# Altium schematic sheet 51单片机密码锁.SchDoc
size A4
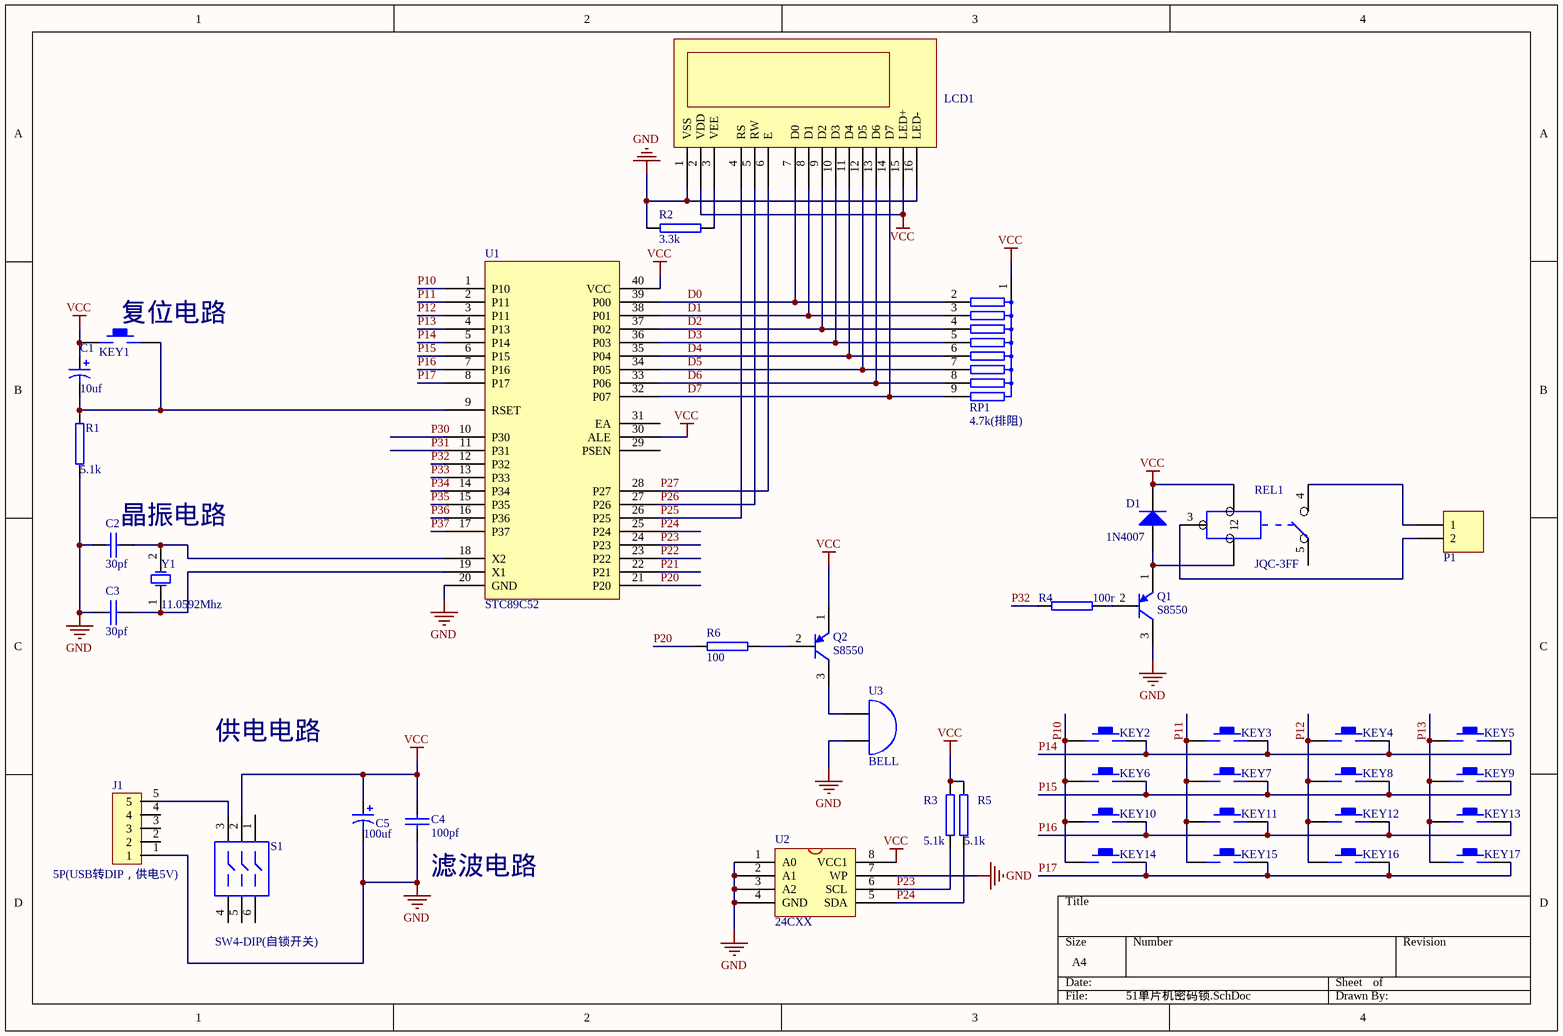
[diagram p0: 51单片机密码锁.SchDoc]

## Parts
C1  10uf  [RB.2/.4]
C2  30pf  [C0.2]
C3  30pf  [C0.2]
C4  100pf  [C0.2]
C5  100uf  [RB.2/.4]
D1  Type: 1N4007  [DIODE-0.4]  (hidden comment: Diode)
J1  5P(USB转DIP，供电5V)  [5P]
KEY1  KEY  [KEY]  (value not drawn)
KEY2  KEY  [KEY]  (value not drawn)
KEY3  KEY  [KEY]  (value not drawn)
KEY4  KEY  [KEY]  (value not drawn)
KEY5  KEY  [KEY]  (value not drawn)
KEY6  KEY  [KEY]  (value not drawn)
KEY7  KEY  [KEY]  (value not drawn)
KEY8  KEY  [KEY]  (value not drawn)
KEY9  KEY  [KEY]  (value not drawn)
KEY10  KEY  [KEY]  (value not drawn)
KEY11  KEY  [KEY]  (value not drawn)
KEY12  KEY  [KEY]  (value not drawn)
KEY13  KEY  [KEY]  (value not drawn)
KEY14  KEY  [KEY]  (value not drawn)
KEY15  KEY  [KEY]  (value not drawn)
KEY16  KEY  [KEY]  (value not drawn)
KEY17  KEY  [KEY]  (value not drawn)
LCD1  LCD1602  [SIP16]  (value not drawn)
P1  Header 2  [HDR2X1_A]  (value not drawn)
Q1  S8550  [TO-92A]
Q2  S8550  [TO-92A]
R1  5.1k  [AXIAL0.4]
R2  3.3k  [AXIAL0.4]
R3  5.1k  [AXIAL0.4]
R4  100r  [AXIAL0.4]
R5  5.1k  [AXIAL0.4]
R6  100  [AXIAL0.4]
REL1  JQC-3FF  [JQC-3FF-1]
RP1  4.7k(排阻)  [SIP9]
S1  SW4-DIP(自锁开关)  [SW6]
U1  STC89C52  [DIP40]
U2  24CXX  [DIP8]
U3  BELL  [BELL]
Y1  11.0592Mhz  [CRYSTAL]

## Nets
GND: C2.1 C3.1 C4.1 C5.2 J1.1 LCD1.1(VSS) LCD1.16(LED-) Q1.3(C) R1.1 R2.1 U1.20(GND) U2.1(A0) U2.2(A1) U2.3(A2) U2.4(GND) U2.7(WP) U3.2(B)
VCC: C1.1 C4.2 C5.1 D1.2(K) KEY1.1 LCD1.2(VDD) LCD1.15(LED+) Q2.1(E) R3.2 R5.2 REL1.2 RP1.1 S1.2 U1.30(ALE) U1.40(VCC) U2.8(VCC1)
D0: LCD1.7(D0) RP1.2 U1.39(P00)
D1: LCD1.8(D1) RP1.3 U1.38(P01)
D2: LCD1.9(D2) RP1.4 U1.37(P02)
D3: LCD1.10(D3) RP1.5 U1.36(P03)
D4: LCD1.11(D4) RP1.6 U1.35(P04)
D5: LCD1.12(D5) RP1.7 U1.34(P05)
D6: LCD1.13(D6) RP1.8 U1.33(P06)
D7: LCD1.14(D7) RP1.9 U1.32(P07)
P10: KEY2.1 KEY6.1 KEY10.1 KEY14.1 U1.1(P10)
P11: KEY3.1 KEY7.1 KEY11.1 KEY15.1 U1.2(P11)
P12: KEY4.1 KEY8.1 KEY12.1 KEY16.1 U1.3(P11)
P13: KEY5.1 KEY9.1 KEY13.1 KEY17.1 U1.4(P13)
P14: KEY2.2 KEY3.2 KEY4.2 KEY5.2 U1.5(P14)
P15: KEY6.2 KEY7.2 KEY8.2 KEY9.2 U1.6(P15)
P16: KEY10.2 KEY11.2 KEY12.2 KEY13.2 U1.7(P16)
P17: KEY14.2 KEY15.2 KEY16.2 KEY17.2 U1.8(P17)
P20: R6.1 U1.21(P20)
P21: U1.22(P21)
P22: U1.23(P22)
P23: R3.1 U1.24(P23) U2.6(SCL)
P24: R5.1 U1.25(P24) U2.5(SDA)
P25: LCD1.4(RS) U1.26(P25)
P26: LCD1.5(RW) U1.27(P26)
P27: LCD1.6(E) U1.28(P27)
P30: U1.10(P30)
P31: U1.11(P31)
P32: R4.1 U1.12(P32)
P33: U1.13(P33)
P34: U1.14(P34)
P35: U1.15(P35)
P36: U1.16(P36)
P37: U1.17(P37)
NetC1_2: C1.2 KEY1.2 R1.2 U1.9(RSET)
NetC2_2: C2.2 U1.18(X2) Y1.2(OSC2)
NetC3_2: C3.2 U1.19(X1) Y1.1(OSC1)
NetD1_1: D1.1(A) Q1.1(E) REL1.1
NetJ1_5: J1.5 S1.3
NetLCD1_3: LCD1.3(VEE) R2.2
NetP1_1: P1.1 REL1.4
NetP1_2: P1.2 REL1.3
NetQ1_2: Q1.2(B) R4.2
NetQ2_2: Q2.2(B) R6.2
NetQ2_3: Q2.3(C) U3.1(A)

Not connected (* = marked no-connect by the designer): J1 2 3 4; REL1 5; S1 1 4 5 6; U1 29(PSEN) 31(EA)

## Notes on the sheet
- (near KEY1) 复位电路
- (near C2) 晶振电路
- 供电电路
- (near C4) 滤波电路

## Library data of the parts
C1 C5 = CAPPOL: Polarized Capacitor (Axial); Published: 8-Jun-2000; LatestRevisionDate: 17-Jul-2002; LatestRevisionNote: Re-released for DXP Platform.; PackageReference: POLAR0.8; Publisher: Altium Limited
  C1: Vaule: 10uf
  C5: Vaule: 100uF
C2 C3 = CAP: Value: 30pF
C4 = CAP: Value: 30pF
D1 = Diode: 二极管; Published: 8-Jun-2000; LatestRevisionDate: 17-Jul-2002; LatestRevisionNote: Re-released for DXP Platform.; PackageDocument: Sep-1996; PackageReference: SMC; Publisher: Altium Limited; Code_JEDEC: DO-214-AB
J1 = 5P
KEY2-KEY17 = KEY: 按键
P1 = Header 2: 接插件; LatestRevisionDate: 17-Jul-2002; LatestRevisionNote: Re-released for DXP Platform.; Publisher: Altium Limited
Q1 Q2 = S8550: PNP三极管; Published: 8-Jun-2000; LatestRevisionDate: 15-Jan-2003; LatestRevisionNote: PCB Footprint 'BCY-W3/D4.7' replaced; DatasheetDocument: 1997; PackageDocument: Sep-1998; PackageReference: TO-92A; Publisher: Altium Limited; Code_JEDEC: TO-92A; ComponentLink1Description: Manufacturer Link; ComponentLink1URL: http://www.fairchildsemi.com/; ComponentLink2Description: Datasheet; ComponentLink2URL: http://www.fairchildsemi.com/ds/2N%2F2N3906.pdf
R1 R3-R5 = RES: Vaule: 1K
R2 R6 = RES: 电阻; Vaule: 1K
REL1 = REL-5: 继电器
RP1 = RP8
S1 = SW4-DIP
U2 = 24CXX: 存储芯片
U3 = BELL: 蜂鸣器
Y1 = XTAL: Crystal Oscillator; Published: *; LatestRevisionDate: *; LatestRevisionNote: *; Publisher: *